# EAGLE design AS3364 DG412 bus mixer v1.3 (EAGLE 9.6.2)
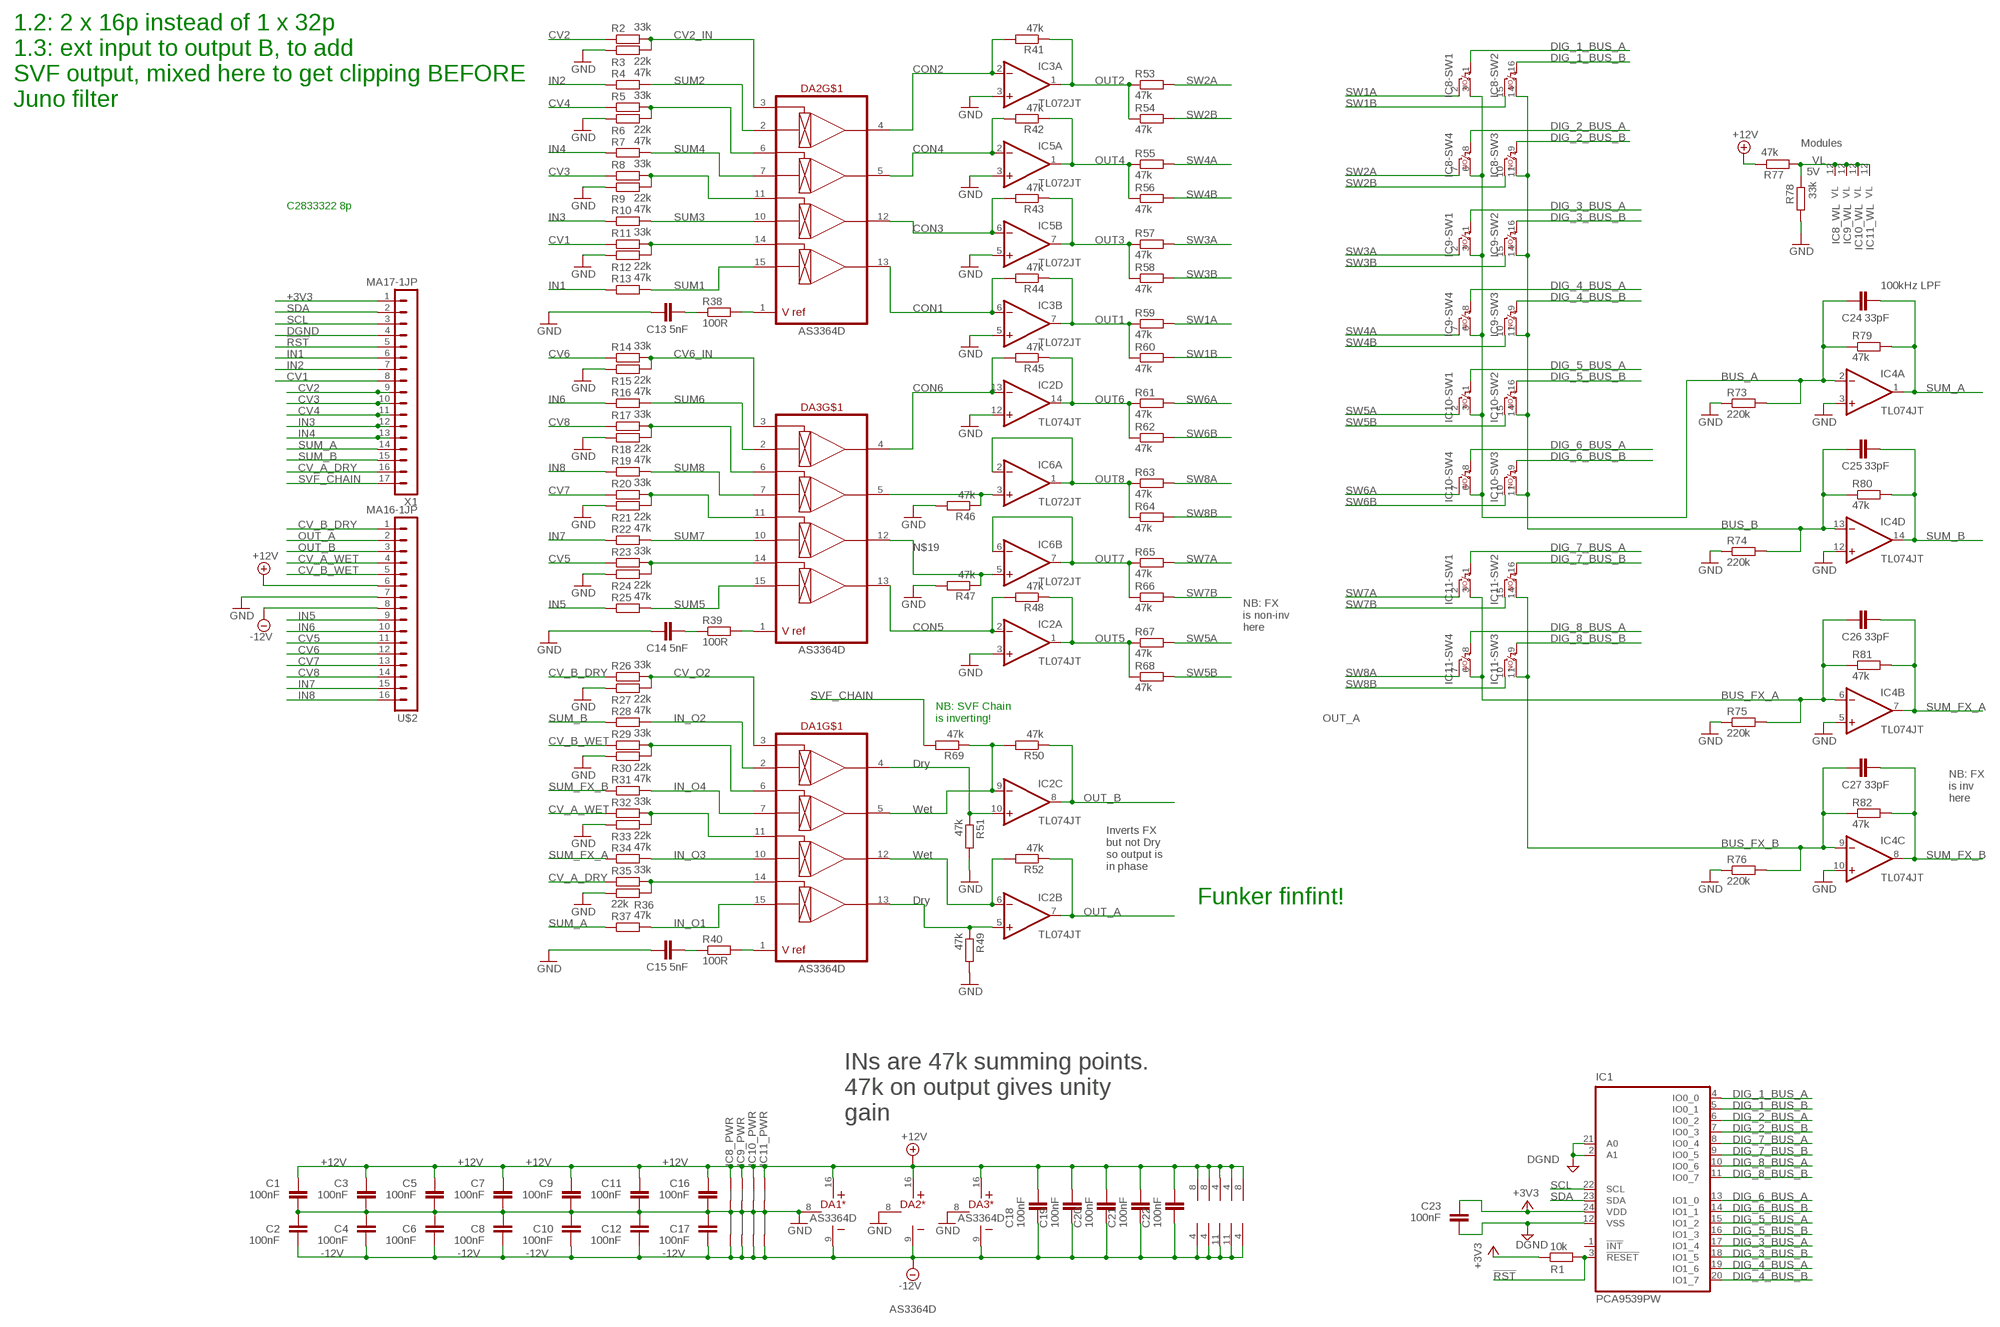
[diagram p0: schematic, sheet 1]

## Parts
C1  100nF  C-EUC0402  [C0402]
C2  100nF  C-EUC0402  [C0402]
C3  100nF  C-EUC0402  [C0402]
C4  100nF  C-EUC0402  [C0402]
C5  100nF  C-EUC0402  [C0402]
C6  100nF  C-EUC0402  [C0402]
C7  100nF  C-EUC0402  [C0402]
C8  100nF  C-EUC0402  [C0402]
C9  100nF  C-EUC0402  [C0402]
C10  100nF  C-EUC0402  [C0402]
C11  100nF  C-EUC0402  [C0402]
C12  100nF  C-EUC0402  [C0402]
C13  5nF  C-EU-J  [C0402-J]
C14  5nF  C-EU-J  [C0402-J]
C15  5nF  C-EU-J  [C0402-J]
C16  100nF  C-EUC0402  [C0402]
C17  100nF  C-EUC0402  [C0402]
C18  100nF  C-EUC0402  [C0402]
C19  100nF  C-EUC0402  [C0402]
C20  100nF  C-EUC0402  [C0402]
C21  100nF  C-EUC0402  [C0402]
C22  100nF  C-EUC0402  [C0402]
C23  100nF  C-EUC0402  [C0402]
C24  33pF  C-EU-J  [C0402-J]
C25  33pF  C-EU-J  [C0402-J]
C26  33pF  C-EU-J  [C0402-J]
C27  33pF  C-EU-J  [C0402-J]
DA1  AS3364D  [DIL16J]
DA2  AS3364D  [DIL16J]
DA3  AS3364D  [DIL16J]
IC1  PCA9539PW  [TSSOP24J]
IC2  TL074JT  [TSSOP14J]
IC3  TL072JT  [TSSOP8J]
IC4  TL074JT  [TSSOP14J]
IC5  TL072JT  [TSSOP8J]
IC6  TL072JT  [TSSOP8J]
IC8  DG412-J  [DIL16J]
IC9  DG412-J  [DIL16J]
IC10  DG412-J  [DIL16J]
IC11  DG412-J  [DIL16J]
R1  10k  R-EU_R0402  [R0402]
R2  33k  R-EU_R0402  [R0402]
R3  22k  R-EU_R0402  [R0402]
R4  47k  R-EU_R0402  [R0402]
R5  33k  R-EU_R0402  [R0402]
R6  22k  R-EU_R0402  [R0402]
R7  47k  R-EU_R0402  [R0402]
R8  33k  R-EU_R0402  [R0402]
R9  22k  R-EU_R0402  [R0402]
R10  47k  R-EU_R0402  [R0402]
R11  33k  R-EU_R0402  [R0402]
R12  22k  R-EU_R0402  [R0402]
R13  47k  R-EU_R0402  [R0402]
R14  33k  R-EU_R0402  [R0402]
R15  22k  R-EU_R0402  [R0402]
R16  47k  R-EU_R0402  [R0402]
R17  33k  R-EU_R0402  [R0402]
R18  22k  R-EU_R0402  [R0402]
R19  47k  R-EU_R0402  [R0402]
R20  33k  R-EU_R0402  [R0402]
R21  22k  R-EU_R0402  [R0402]
R22  47k  R-EU_R0402  [R0402]
R23  33k  R-EU_R0402  [R0402]
R24  22k  R-EU_R0402  [R0402]
R25  47k  R-EU_R0402  [R0402]
R26  33k  R-EU_R0402  [R0402]
R27  22k  R-EU_R0402  [R0402]
R28  47k  R-EU_R0402  [R0402]
R29  33k  R-EU_R0402  [R0402]
R30  22k  R-EU_R0402  [R0402]
R31  47k  R-EU_R0402  [R0402]
R32  33k  R-EU_R0402  [R0402]
R33  22k  R-EU_R0402  [R0402]
R34  47k  R-EU_R0402  [R0402]
R35  33k  R-EU_R0402  [R0402]
R36  22k  R-EU_R0402  [R0402]
R37  47k  R-EU_R0402  [R0402]
R38  100R  R-EU_R0402  [R0402]
R39  100R  R-EU_R0402  [R0402]
R40  100R  R-EU_R0402  [R0402]
R41  47k  R-EU_R0402  [R0402]
R42  47k  R-EU_R0402  [R0402]
R43  47k  R-EU_R0402  [R0402]
R44  47k  R-EU_R0402  [R0402]
R45  47k  R-EU_R0402  [R0402]
R46  47k  R-EU_R0402  [R0402]
R47  47k  R-EU_R0402  [R0402]
R48  47k  R-EU_R0402  [R0402]
R49  47k  R-EU_R0402  [R0402]
R50  47k  R-EU_R0402  [R0402]
R51  47k  R-EU_R0402  [R0402]
R52  47k  R-EU_R0402  [R0402]
R53  47k  R-EU_R0402  [R0402]
R54  47k  R-EU_R0402  [R0402]
R55  47k  R-EU_R0402  [R0402]
R56  47k  R-EU_R0402  [R0402]
R57  47k  R-EU_R0402  [R0402]
R58  47k  R-EU_R0402  [R0402]
R59  47k  R-EU_R0402  [R0402]
R60  47k  R-EU_R0402  [R0402]
R61  47k  R-EU_R0402  [R0402]
R62  47k  R-EU_R0402  [R0402]
R63  47k  R-EU_R0402  [R0402]
R64  47k  R-EU_R0402  [R0402]
R65  47k  R-EU_R0402  [R0402]
R66  47k  R-EU_R0402  [R0402]
R67  47k  R-EU_R0402  [R0402]
R68  47k  R-EU_R0402  [R0402]
R69  47k  R-EU_R0402  [R0402]
R73  220k  R-EU_R0402  [R0402]
R74  220k  R-EU_R0402  [R0402]
R75  220k  R-EU_R0402  [R0402]
R76  220k  R-EU_R0402  [R0402]
R77  47k  R-EU_R0402  [R0402]
R78  33k  R-EU_R0402  [R0402]
R79  47k  R-EU_R0402  [R0402]
R80  47k  R-EU_R0402  [R0402]
R81  47k  R-EU_R0402  [R0402]
R82  47k  R-EU_R0402  [R0402]
U$2  MA16-1JP  [SIP-PIN16-1J]
X1  MA17-1JP  [SIP-PIN17-1J]

## Nets
!RST: IC1.3(!RESET) R1.2 X1.5
+3V3: C23.2 IC1.24(VDD) R1.1 X1.1
+12V: C1.2 C3.2 C5.2 C7.2 C9.2 C11.2 C16.2 C18.2 C19.2 C20.2 C21.2 C22.2 DA1.16(*:V+) DA2.16(*:V+) DA3.16(*:V+) IC2.4(P:V+) IC3.8(P:V+) IC4.4(P:V+) IC5.8(P:V+) IC6.8(P:V+) IC8.13(_PWR:+15V) IC9.13(_PWR:+15V) IC10.13(_PWR:+15V) IC11.13(_PWR:+15V) R77.1 U$2.6
-12V: C2.1 C4.1 C6.1 C8.1 C10.1 C12.1 C17.1 C18.1 C19.1 C20.1 C21.1 C22.1 DA1.9(*:V-) DA2.9(*:V-) DA3.9(*:V-) IC2.11(P:V-) IC3.4(P:V-) IC4.11(P:V-) IC5.4(P:V-) IC6.4(P:V-) IC8.4(_PWR:-15V) IC9.4(_PWR:-15V) IC10.4(_PWR:-15V) IC11.4(_PWR:-15V) U$2.8
BUS_A: C24.1 IC4.2(A:-IN) IC8.3(-SW1:S) IC8.6(-SW4:S) IC9.3(-SW1:S) IC9.6(-SW4:S) IC10.3(-SW1:S) IC10.6(-SW4:S) R73.2 R79.1
BUS_B: C25.1 IC4.13(D:-IN) IC8.11(-SW3:S) IC8.14(-SW2:S) IC9.11(-SW3:S) IC9.14(-SW2:S) IC10.11(-SW3:S) IC10.14(-SW2:S) R74.2 R80.1
BUS_FX_A: C26.1 IC4.6(B:-IN) IC11.3(-SW1:S) IC11.6(-SW4:S) R75.2 R81.1
BUS_FX_B: C27.1 IC4.9(C:-IN) IC11.11(-SW3:S) IC11.14(-SW2:S) R76.2 R82.1
CON1: DA2.13(OUT4) IC3.6(B:-IN) R44.2
CON2: DA2.4(OUT1) IC3.2(A:-IN) R41.2
CON3: DA2.12(OUT3) IC5.6(B:-IN) R43.2
CON4: DA2.5(OUT2) IC5.2(A:-IN) R42.2
CON5: DA3.13(OUT4) IC2.2(A:-IN) R48.2
CON6: DA3.4(OUT1) IC2.13(D:-IN) R45.2
CON_O1: DA1.12(OUT3) IC2.6(B:-IN) R52.2
CV1: R11.1 X1.8
CV2: R2.1 X1.9
CV2_IN: DA2.3(CV1) R2.2 R3.2
CV3: R8.1 X1.10
CV4: R5.1 X1.11
CV5: R23.1 U$2.11
CV6: R14.1 U$2.12
CV6_IN: DA3.3(CV1) R14.2 R15.2
CV7: R20.1 U$2.13
CV8: R17.1 U$2.14
CV_A_DRY: R35.1 X1.16
CV_A_WET: R32.1 U$2.4
CV_B_DRY: R26.1 U$2.1
CV_B_WET: R29.1 U$2.5
CV_O2: DA1.3(CV1) R26.2 R27.2
DGND: C23.1 IC1.2(A1) IC1.12(VSS) IC1.21(A0) X1.4
DIG_1_BUS_A: IC1.4(IO0_0) IC8.1(-SW1:C)
DIG_1_BUS_B: IC1.5(IO0_1) IC8.16(-SW2:C)
DIG_2_BUS_A: IC1.6(IO0_2) IC8.8(-SW4:C)
DIG_2_BUS_B: IC1.7(IO0_3) IC8.9(-SW3:C)
DIG_3_BUS_A: IC1.17(IO1_4) IC9.1(-SW1:C)
DIG_3_BUS_B: IC1.18(IO1_5) IC9.16(-SW2:C)
DIG_4_BUS_A: IC1.19(IO1_6) IC9.8(-SW4:C)
DIG_4_BUS_B: IC1.20(IO1_7) IC9.9(-SW3:C)
DIG_5_BUS_A: IC1.15(IO1_2) IC10.1(-SW1:C)
DIG_5_BUS_B: IC1.16(IO1_3) IC10.16(-SW2:C)
DIG_6_BUS_A: IC1.13(IO1_0) IC10.8(-SW4:C)
DIG_6_BUS_B: IC1.14(IO1_1) IC10.9(-SW3:C)
DIG_7_BUS_A: IC1.8(IO0_4) IC11.1(-SW1:C)
DIG_7_BUS_B: IC1.9(IO0_5) IC11.16(-SW2:C)
DIG_8_BUS_A: IC1.10(IO0_6) IC11.8(-SW4:C)
DIG_8_BUS_B: IC1.11(IO0_7) IC11.9(-SW3:C)
GND: C1.1 C2.2 C3.1 C4.2 C5.1 C6.2 C7.1 C8.2 C9.1 C10.2 C11.1 C12.2 C13.1 C14.1 C15.1 C16.1 C17.2 DA1.8(*:GND) DA2.8(*:GND) DA3.8(*:GND) IC2.3(A:+IN) IC2.12(D:+IN) IC3.3(A:+IN) IC3.5(B:+IN) IC4.3(A:+IN) IC4.5(B:+IN) IC4.10(C:+IN) IC4.12(D:+IN) IC5.3(A:+IN) IC5.5(B:+IN) IC8.5(_PWR:AGND) IC9.5(_PWR:AGND) IC10.5(_PWR:AGND) IC11.5(_PWR:AGND) R3.1 R6.1 R9.1 R12.1 R15.1 R18.1 R21.1 R24.1 R27.1 R30.1 R33.1 R36.1 R46.2 R47.2 R49.2 R51.2 R73.1 R74.1 R75.1 R76.1 R78.2 U$2.7
IN1: R13.1 X1.6
IN2: R4.1 X1.7
IN3: R10.1 X1.12
IN4: R7.1 X1.13
IN5: R25.1 U$2.9
IN6: R16.1 U$2.10
IN7: R22.1 U$2.15
IN8: R19.1 U$2.16
IN_O1: DA1.15(IN4) R37.2
IN_O2: DA1.2(IN1) R28.2
IN_O3: DA1.10(IN3) R34.2
IN_O4: DA1.7(IN2) R31.2
N$1: DA3.1(VREF) R39.2
N$2: DA2.1(VREF) R38.2
N$3: DA3.6(CV2) R17.2 R18.2
N$4: DA3.5(OUT2) IC6.3(A:+IN) R46.1
N$5: DA3.11(CV3) R20.2 R21.2
N$6: DA1.5(OUT2) IC2.9(C:-IN) R50.2 R69.1
N$7: DA3.14(CV4) R23.2 R24.2
N$8: C14.2 R39.1
N$9: DA1.1(VREF) R40.2
N$10: DA2.6(CV2) R5.2 R6.2
N$11: DA1.6(CV2) R29.2 R30.2
N$12: DA2.11(CV3) R8.2 R9.2
N$13: DA1.11(CV3) R32.2 R33.2
N$14: C13.2 R38.1
N$15: DA1.14(CV4) R35.2 R36.2
N$16: C15.2 R40.1
N$17: DA1.4(OUT1) IC2.10(C:+IN) R51.1
N$18: DA1.13(OUT4) IC2.5(B:+IN) R49.1
N$19: DA3.12(OUT3) IC6.5(B:+IN) R47.1
N$21: DA2.14(CV4) R11.2 R12.2
OUT1: IC3.7(B:OUT) R44.1 R59.1 R60.1
OUT2: IC3.1(A:OUT) R41.1 R53.1 R54.1
OUT3: IC5.7(B:OUT) R43.1 R57.1 R58.1
OUT4: IC5.1(A:OUT) R42.1 R55.1 R56.1
OUT5: IC2.1(A:OUT) R48.1 R67.1 R68.1
OUT6: IC2.14(D:OUT) R45.1 R61.1 R62.1
OUT7: IC6.6(B:-IN) IC6.7(B:OUT) R65.1 R66.1
OUT8: IC6.1(A:OUT) IC6.2(A:-IN) R63.1 R64.1
OUT_A: IC2.7(B:OUT) R52.1 U$2.2
OUT_B: IC2.8(C:OUT) R50.1 U$2.3
SCL: IC1.22(SCL) X1.3
SDA: IC1.23(SDA) X1.2
SUM1: DA2.15(IN4) R13.2
SUM2: DA2.2(IN1) R4.2
SUM3: DA2.10(IN3) R10.2
SUM4: DA2.7(IN2) R7.2
SUM5: DA3.15(IN4) R25.2
SUM6: DA3.2(IN1) R16.2
SUM7: DA3.10(IN3) R22.2
SUM8: DA3.7(IN2) R19.2
SUM_A: C24.2 IC4.1(A:OUT) R37.1 R79.2 X1.14
SUM_B: C25.2 IC4.14(D:OUT) R28.1 R80.2 X1.15
SUM_FX_A: C26.2 IC4.7(B:OUT) R34.1 R81.2
SUM_FX_B: C27.2 IC4.8(C:OUT) R31.1 R82.2
SVF_CHAIN: R69.2 X1.17
SW1A: IC8.2(-SW1:D) R59.2
SW1B: IC8.15(-SW2:D) R60.2
SW2A: IC8.7(-SW4:D) R53.2
SW2B: IC8.10(-SW3:D) R54.2
SW3A: IC9.2(-SW1:D) R57.2
SW3B: IC9.15(-SW2:D) R58.2
SW4A: IC9.7(-SW4:D) R55.2
SW4B: IC9.10(-SW3:D) R56.2
SW5A: IC10.2(-SW1:D) R67.2
SW5B: IC10.15(-SW2:D) R68.2
SW6A: IC10.7(-SW4:D) R61.2
SW6B: IC10.10(-SW3:D) R62.2
SW7A: IC11.2(-SW1:D) R65.2
SW7B: IC11.15(-SW2:D) R66.2
SW8A: IC11.7(-SW4:D) R63.2
SW8B: IC11.10(-SW3:D) R64.2
VL: IC8.12(_WL:VL) IC9.12(_WL:VL) IC10.12(_WL:VL) IC11.12(_WL:VL) R77.2 R78.1
Unconnected: IC1.1(!INT)

## Notes on the sheet
- 1.2: 2 x 16p instead of 1 x 32p
  1.3: ext input to output B, to add
  SVF output, mixed here to get clipping BEFORE
  Juno filter
- Modules
- 5V
- C2833322 8p
- 100kHz LPF
- NB: FX
  is non-inv
  here
- NB: SVF Chain
  is inverting!
- Dry
- NB: FX
  is inv
  here
- Wet
- Wet
- Inverts FX
  but not Dry
  so output is
  in phase
- Dry | Funker finfint!
- INs are 47k summing points.
  47k on output gives unity
  gain

## Library data of the parts
C1-C12 C16-C23 = rcl:C-EU: CAPACITOR, European symbol; SPICEPREFIX: C
C13-C15 C24-C27 = joakim:C-EU-J: CAPACITOR, European symbol
DA1-DA3 = joakim:AS3364: AS3364 quad linear VCA, CEM3360 style. CV is 0 to 2V Vcc-Vee = 26V max, so +/-12V or +15V/-9V
IC1 = joakim:PCA9539: 16ch i/o expander. RPW version resets only internal statemachine to get out of stuck i2c-bus, other versions also reset outputs. Interrupt output requires external pull-up resistor for all variants. https://www.nxp.com/docs/en/data-sheet/PCA9539_PCA9539R.pdf
IC2 IC4 = joakim:TL074J: OP AMP
IC3 IC5 IC6 = joakim:TL072J: OP AMP
IC8-IC11 = joakim:DG412-J: Quad switch, normally open
R1-R69 R73-R82 = rcl:R-EU_: RESISTOR, European symbol; SPICEPREFIX: R
U$2 = joakim:MA16-1J
X1 = joakim:MA17-1J

## Board
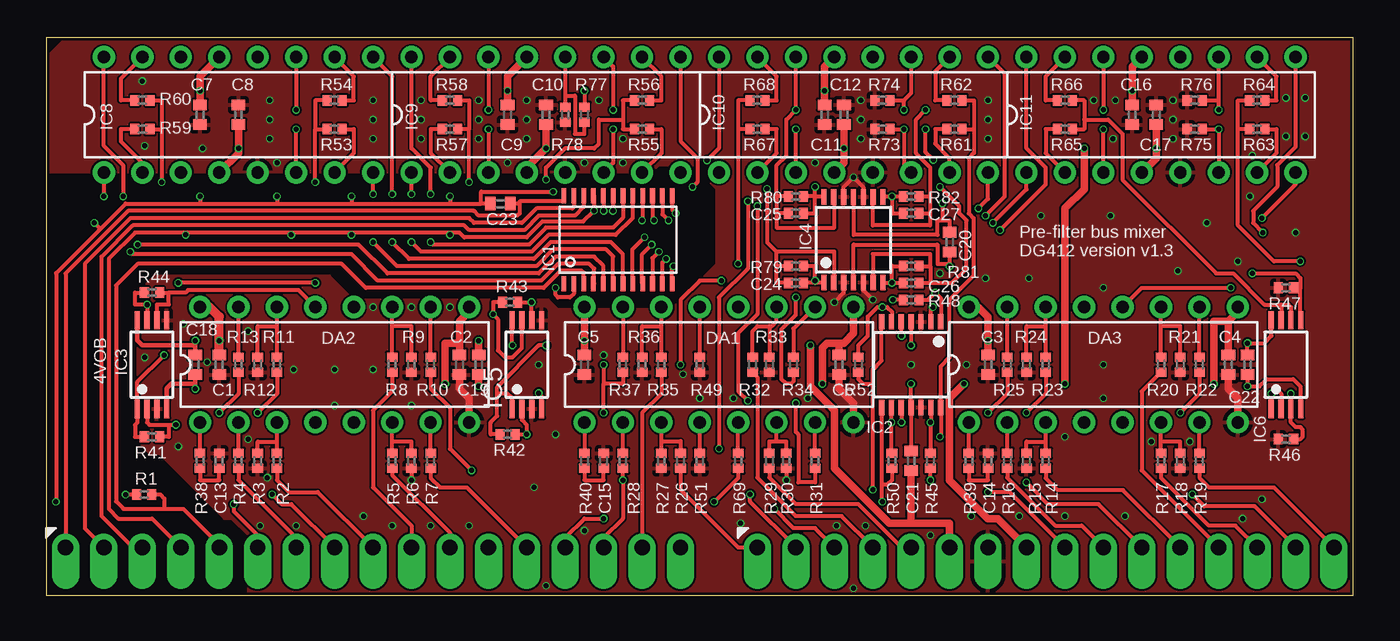
[diagram p1: board, top side]
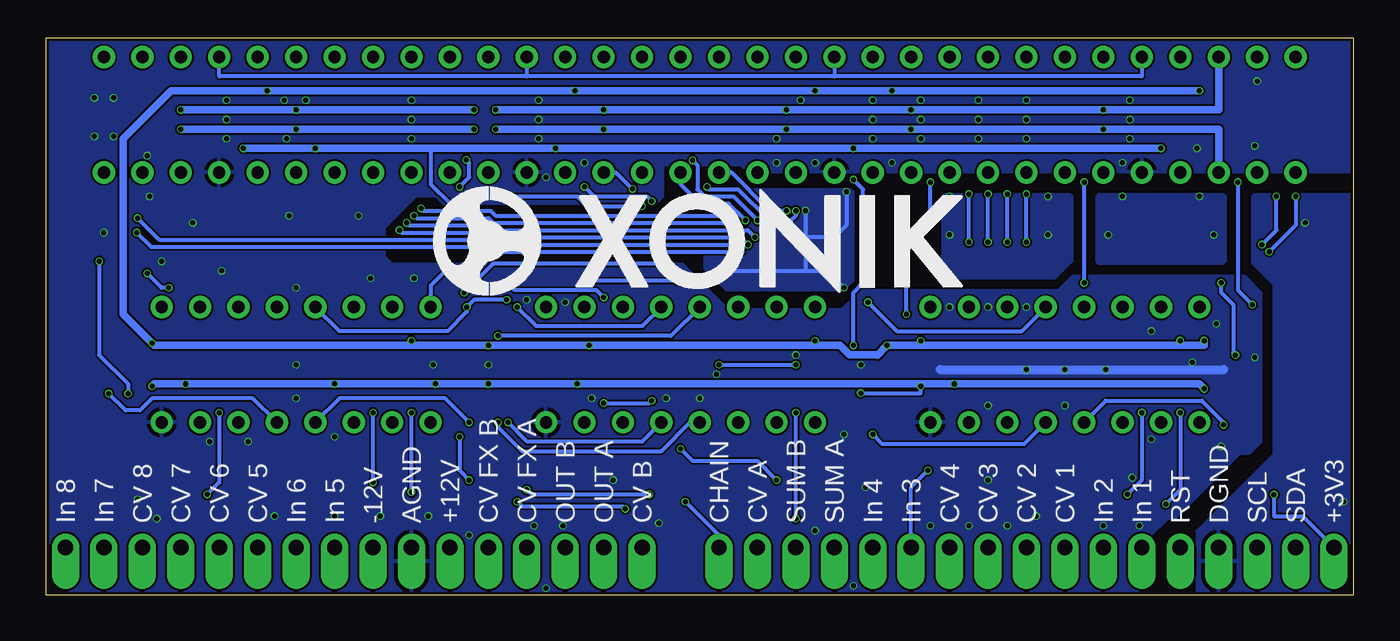
[diagram p2: board, bottom side, seen from below]

Size 86.36 x 36.83 mm. Coordinates in mm from the lower left corner, seen from the top.
Outline: 0,0 86.36,0 86.36,36.83 0,36.83 0,0
Copper layers (1*16): Top 0.035mm / dielectric 1.6mm / Bottom 0.035mm
Design rules "jlcpcb-2layers": minimum track width 5mil, minimum drill 0.3mm, track to track 5mil, track to pad 5mil, pad to pad 5mil, via to via 5mil, smd to smd 5mil, copper to edge 0.2mm, drill to drill 6mil, minimum pad ring 10mil, minimum via ring 3mil, stop-mask expansion 4mil, vias tented up to drill 0mil, thermal gap 10mil

### Footprints (pad centres in the part's own frame; a part is rotated, then mirrored left to right if it is on the bottom)
C0402 = smd 0.7 x 0.9: 1 -0.65,0; 2 0.65,0
C0402-J = smd 0.6 x 0.7: 1 -0.5,0; 2 0.5,0
DIL16J = drill 0.813: 1 -8.89,-3.81; 2 -6.35,-3.81; 3 -3.81,-3.81; 4 -1.27,-3.81; 5 1.27,-3.81; 6 3.81,-3.81; 7 6.35,-3.81; 8 8.89,-3.81; 9 8.89,3.81; 10 6.35,3.81; 11 3.81,3.81; 12 1.27,3.81; 13 -1.27,3.81; 14 -3.81,3.81; 15 -6.35,3.81; 16 -8.89,3.81
TSSOP24J = smd 0.305 x 0.991: 1 -3.575,-2.918; 2 -2.925,-2.918; 3 -2.275,-2.918; 4 -1.625,-2.918; 5 -0.975,-2.918; 6 -0.325,-2.918; 7 0.325,-2.918; 8 0.975,-2.918; 9 1.625,-2.918; 10 2.275,-2.918; 11 2.925,-2.918; 12 3.575,-2.918; 13 3.575,2.918; 14 2.925,2.918; 15 2.275,2.918; 16 1.625,2.918; 17 0.975,2.918; 18 0.325,2.918; 19 -0.325,2.918; 20 -0.975,2.918; 21 -1.625,2.918; 22 -2.275,2.918; 23 -2.925,2.918; 24 -3.575,2.918
TSSOP14J = smd 0.35 x 1: 1 -1.95,-2.825; 2 -1.3,-2.825; 3 -0.65,-2.825; 4 0,-2.825; 5 0.65,-2.825; 6 1.3,-2.825; 7 1.95,-2.825; 8 1.95,2.825; 9 1.3,2.825; 10 0.65,2.825; 11 0,2.825; 12 -0.65,2.825; 13 -1.3,2.825; 14 -1.95,2.825
TSSOP8J = smd 1.2 x 0.35: 1 -2.925,0.975; 2 -2.925,0.325; 3 -2.925,-0.325; 4 -2.925,-0.975; 5 2.925,-0.975; 6 2.925,-0.325; 7 2.925,0.325; 8 2.925,0.975
R0402 = smd 0.6 x 0.7: 1 -0.5,0; 2 0.5,0
SIP-PIN16-1J = drill 1.016 offset: 1 -19.05,0; 2 -16.51,0; 3 -13.97,0; 4 -11.43,0; 5 -8.89,0; 6 -6.35,0; 7 -3.81,0; 8 -1.27,0; 9 1.27,0; 10 3.81,0; 11 6.35,0; 12 8.89,0; 13 11.43,0; 14 13.97,0; 15 16.51,0; 16 19.05,0
SIP-PIN17-1J = drill 1.016 offset: 1 -20.32,0; 2 -17.78,0; 3 -15.24,0; 4 -12.7,0; 5 -10.16,0; 6 -7.62,0; 7 -5.08,0; 8 -2.54,0; 9 0,0; 10 2.54,0; 11 5.08,0; 12 7.62,0; 13 10.16,0; 14 12.7,0; 15 15.24,0; 16 17.78,0; 17 20.32,0

### Placement (x,y rotation side)
C1  11.43,15.24 90 top
C2  27.3,15.24 270 top
C3  62.23,15.24 90 top
C4  78.1,15.24 270 top
C5  35.56,15.24 90 top
C6  52.39,15.24 270 top
C7  10.16,31.75 90 top
C8  12.7,31.75 90 top
C9  30.48,31.75 90 top
C10  33.02,31.75 90 top
C11  51.44,31.75 90 top
C12  52.71,31.75 90 top
C13  11.43,8.89 270 top
C14  62.23,8.89 270 top
C15  36.83,8.89 270 top
C16  71.75,31.75 90 top
C17  73.34,31.75 90 top
C18  9.84,15.24 90 top
C19  28.57,15.24 90 top
C20  59.69,23.34 270 top
C21  57.15,8.89 270 top
C22  79.38,15.24 90 top
C23  30,25.88 0 top
C24  49.53,21.75 0 top
C25  49.53,25.24 0 top
C26  57.15,21.75 180 top
C27  57.15,25.24 180 top
DA1  44.45,15.24 0 top
DA2  19.05,15.24 0 top
DA3  69.85,15.24 0 top
IC1  37.78,23.5 0 top
IC2  57.15,15.24 180 top
IC3  6.98,15.24 90 top
IC4  53.34,23.5 0 top
IC5  31.75,15.24 90 top
IC6  81.91,15.24 90 top
IC8  12.7,31.75 0 top
IC9  33.02,31.75 0 top
IC10  53.34,31.75 0 top
IC11  73.66,31.75 0 top
R1  6.48,6.67 0 top
R2  15.24,8.89 90 top
R3  13.97,8.89 90 top
R4  12.7,8.89 90 top
R5  22.86,8.89 90 top
R6  24.13,8.89 90 top
R7  25.4,8.89 90 top
R8  22.86,15.24 90 top
R9  24.13,15.24 90 top
R10  25.4,15.24 90 top
R11  15.24,15.24 90 top
R12  13.97,15.24 90 top
R13  12.7,15.24 90 top
R14  66.04,8.89 90 top
R15  64.77,8.89 90 top
R16  63.5,8.89 90 top
R17  73.66,8.89 90 top
R18  74.93,8.89 90 top
R19  76.2,8.89 90 top
R20  73.66,15.24 90 top
R21  74.93,15.24 90 top
R22  76.2,15.24 90 top
R23  66.04,15.24 90 top
R24  64.77,15.24 90 top
R25  63.5,15.24 90 top
R26  41.91,8.89 90 top
R27  40.64,8.89 90 top
R28  38.1,8.89 90 top
R29  47.78,8.89 90 top
R30  48.9,8.89 90 top
R31  50.8,8.89 90 top
R32  46.67,15.24 90 top
R33  47.78,15.24 90 top
R34  49.37,15.24 90 top
R35  40.64,15.24 90 top
R36  39.37,15.24 90 top
R37  38.1,15.24 90 top
R38  10.16,8.89 90 top
R39  60.96,8.89 90 top
R40  35.56,8.89 90 top
R41  6.98,10.48 0 top
R42  30.48,10.64 0 top
R43  30.64,19.37 0 top
R44  6.98,20 0 top
R45  58.42,8.89 90 top
R46  81.91,10.32 180 top
R47  81.91,20.32 180 top
R48  57.15,19.53 180 top
R49  43.18,15.24 270 top
R50  55.88,8.89 90 top
R51  43.18,8.89 270 top
R52  53.66,15.24 90 top
R53  19.05,30.8 0 top
R54  19.05,32.7 0 top
R55  39.37,30.8 0 top
R56  39.37,32.7 0 top
R57  26.67,30.8 180 top
R58  26.67,32.7 180 top
R59  6.35,30.8 180 top
R60  6.35,32.7 180 top
R61  60.01,30.8 180 top
R62  60.01,32.7 180 top
R63  80.01,30.8 0 top
R64  80.01,32.7 0 top
R65  67.31,30.8 180 top
R66  67.31,32.7 180 top
R67  46.99,30.8 0 top
R68  46.99,32.7 0 top
R69  45.72,8.89 270 top
R73  55.25,30.8 0 top
R74  55.25,32.7 0 top
R75  75.88,30.8 0 top
R76  75.88,32.7 0 top
R77  35.56,31.75 270 top
R78  34.29,31.75 270 top
R79  49.53,20.64 0 top
R80  49.53,26.35 0 top
R81  57.15,20.64 180 top
R82  57.15,26.35 180 top
U$1  [XONIK_LOGO_35]  60.8,19.84 0 bottom
U$2  66.04,3.17 0 top
X1  21.59,3.17 0 top

### Tracks (layer width: path | path; a pad name or v marks a point on that pad's centre or on a via)
!RST
  Top 0.254: IC1.3 35.51,21.32 35.4,21.43 33.97,21.43 32.86,20.32 21.11,20.32 19.53,21.91 6.03,21.91 4.6,20.48 4.6,6.21 5.1,5.71 6.35,5.71 | X1.5 11.43,3.33 9.05,5.71 7.8,5.71 | 6.35,5.71 6.64,5.71 | R1.2 7.54,6.67 7.8,6.4 7.8,5.71 | 6.35,5.71 7.8,5.71
+3V3  (via drill 0.33)
  Top 0.254: IC1.24 34.21,26.09 34.15,26.04 31.27,26.04 31.27,25.88 | 31.27,25.88 C23.2 | 31.27,25.88 31.27,25.24 31.11,25.08 28.57,25.08 28.26,25.4 5.4,25.4 1.27,21.27 X1.1 | R1.1 v5.23,6.66
  Bottom 0.254: v5.23,6.66 5.23,5.24 3.33,5.24 X1.1
+12V  (via drill 0.33, 0.35)
  Top 0.254: v35.56,33.34 R77.1 | IC4.4 53.34,23.18 58.88,23.18 58.9,23.16 58.9,21.89 59.53,21.89 v59.69,21.73 C20.2 | C22.2 v79.38,16.67 80.49,16.67 80.96,17.14 80.96,18.14 IC6.8 | IC2.4 v57.15,16.51 | C20.2 | IC5.8 30.77,16.53 v30.8,16.51
  Top 0.305: IC3.8 6.01,16.85 6.35,16.51 9.84,16.51 | 9.84,16.51 C18.2 | 9.84,16.51 v9.84,16.83
  Top 0.508: C3.2 v62.23,16.83 62.23,18.41 61.6,19.05 DA3.16 | C5.2 v35.56,16.83 DA1.16 | C7.2 v10.16,33.34 10.16,34.29 IC8.13 | C9.2 v30.48,33.34 30.48,34.29 IC9.13 | C11.2 v51.44,33.34 51.44,34.92 IC10.13 | C16.2 v71.75,33.34 71.75,34.92 IC11.13 | C19.2 v28.57,16.83 | U$2.6 59.69,4.76 57.15,4.76 | v50.48,16.51 50.48,13.81 52.07,12.22 52.07,8.41 55.72,4.76 57.15,4.76 | C21.2 57.15,4.76
  Top 0.61: C1.2 v11.43,16.83 11.43,18.41 10.79,19.05 DA2.16
  Bottom 0.254: v59.69,21.73 60.96,20.46 DA3.16
  Bottom 0.508: 35.56,16.51 v50.48,16.51 v57.15,16.51 62.23,16.51 | v9.84,16.83 9.84,16.51 11.43,16.51 | v10.16,33.34 v30.48,33.34 v35.56,33.34 v51.44,33.34 v71.75,33.34 78.1,33.34 81.28,30.16 81.28,18.57 v79.38,16.67 79.22,16.51 62.23,16.51 | v35.56,16.83 35.56,16.51 | v62.23,16.83 62.23,16.51 | 11.43,16.51 28.57,16.51 | 28.57,16.51 v30.8,16.51 31.43,15.88 31.45,15.89 33.28,15.89 33.9,16.51 35.56,16.51 | v11.43,16.83 11.43,16.51 | v28.57,16.83 28.57,16.51
-12V  (via drill 0.33, 0.35)
  Top 0.254: v57.15,13.97 IC2.11 C21.1 | IC4.11 53.34,23.81 58.9,23.81 58.9,24.77 59.21,24.77 | C22.1 v79.38,13.81 80.17,13.81 80.64,14.29 82.39,14.29 82.89,13.79 IC6.4 | 59.21,24.77 59.69,24.77 C20.1 | v59.21,25.89 59.21,24.77 | IC5.4 32.73,13.19 v32.54,13.37
  Top 0.305: IC3.4 7.96,13.68 8.26,13.97 9.84,13.97 | 9.84,13.97 C18.1 | 9.84,13.97 v9.84,13.65
  Top 0.508: DA2.9 27.94,18.73 27.3,18.1 27.3,16.67 | 27.3,16.67 C2.1 | 27.3,16.67 26.35,16.67 v26.35,13.97 | DA3.9 78.74,18.73 78.1,18.1 | 78.1,18.1 C4.1 | 78.1,18.1 77.15,18.1 v77.15,13.97 | C6.1 52.39,16.67 | C8.1 v12.7,29.53 12.7,29.21 IC8.4 | IC9.4 31.75,28.26 v33.02,29.53 C10.1 | C12.1 v52.71,29.53 52.71,28.57 IC10.4 | C17.1 v73.34,29.53 73.34,28.89 IC11.4 | v68.58,29.53 68.58,26.83 67.31,25.56 v67.31,13.97 | U$2.8 62.87,5.08 62.23,5.08 59.69,7.62 59.69,13.02 v60.64,13.97 | 52.39,16.67 52.71,16.67 53.34,17.3 DA1.9 | v28.57,13.81 C19.1 | v51.28,13.97 51.28,16.35 51.59,16.67 52.39,16.67
  Bottom 0.254: v59.21,25.89 59.69,25.89 60.96,27.16 60.96,29.53 | v68.58,29.53 69.21,29.53 | v32.54,13.37 28.57,13.37 28.57,13.97
  Bottom 0.508: v9.84,13.65 10.16,13.97 v26.35,13.97 28.57,13.97 | 28.57,13.97 v51.28,13.97 v57.15,13.97 v60.64,13.97 v67.31,13.97 v77.15,13.97 79.22,13.97 v79.38,13.81 | v12.7,29.53 v33.02,29.53 v52.71,29.53 60.96,29.53 69.21,29.53 v73.34,29.53 | 28.57,13.97 v28.57,13.81
BUS_A  (via drill 0.33)
  Top 0.254: v29.21,30.8 IC9.3 | v37.47,30.8 37.47,28.57 IC9.6 | IC8.6 v16.51,30.8 | IC10.3 v49.53,30.8 | IC10.6 56.67,28.42 v56.67,30.8 R73.2 | IC4.2 52.07,20.7 52.07,22.7 48.26,22.7 | v47.62,26.85 47.62,23.34 48.26,22.7 | R79.1 48.26,20.64 48.26,21.75 | 48.26,21.75 48.26,22.7 | C24.1 48.26,21.75
  Bottom 0.254: IC10.3 48.74,27.94 47.64,26.85 v47.62,26.85
  Bottom 0.508: IC8.3 8.89,30.8 v16.51,30.8 v29.21,30.8 v37.47,30.8 v49.53,30.8 v56.67,30.8
BUS_B  (via drill 0.33)
  Top 0.254: IC8.11 v16.51,32.07 | IC9.14 v29.21,32.07 | IC9.11 37.47,34.92 v37.47,32.07 | IC10.14 v49.53,32.07 48.9,31.43 48.9,29.05 48.26,28.42 48.26,26.35 | v56.67,32.07 56.67,32.7 | R74.2 56.67,32.7 | 48.26,26.35 48.26,25.24 | 48.26,25.24 48.26,24.29 52.07,24.29 52.07,26.29 IC4.13 | R80.1 48.26,26.35 | IC10.11 57.15,33.18 56.67,32.7 | C25.1 48.26,25.24
  Bottom 0.508: IC8.14 8.89,32.07 v16.51,32.07 v29.21,32.07 v37.47,32.07 v49.53,32.07 v56.67,32.07
BUS_FX_A  (via drill 0.33)
  Top 0.254: IC11.3 v69.85,30.8 | IC11.6 v77.47,30.8 R75.2 | R81.1 58.42,20.64 | IC4.6 54.61,20.7 54.61,22.54 58.42,22.54 58.42,21.75 | v58.61,28.77 58.1,29.27 v58.1,30.8 | 58.42,21.75 58.42,20.64 | v59.05,26.99 60.33,25.72 60.33,25.24 60.8,24.77 60.8,21.59 59.85,20.64 58.42,20.64 | C26.1 58.42,21.75
  Bottom 0.254: v58.61,28.77 58.42,28.57 58.42,27.62 v59.05,26.99
  Bottom 0.508: v77.47,30.8 v69.85,30.8 v58.1,30.8
BUS_FX_B  (via drill 0.33)
  Top 0.254: IC11.14 v69.85,32.07 | v77.47,32.07 77.47,32.7 | 77.47,32.7 IC11.11 | R76.2 77.47,32.7 | R82.1 58.42,26.35 | 58.42,25.24 58.42,24.45 54.61,24.45 54.61,26.29 IC4.9 | 58.42,25.24 58.42,26.35 | 58.42,26.35 58.42,28.26 57.47,29.21 57.47,31.43 v58.1,32.07 | C27.1 58.42,25.24
  Bottom 0.508: v77.47,32.07 v69.85,32.07 v58.1,32.07
CON1
  Top 0.254: DA2.13 16.67,20.16 9.37,20.16 9.21,20 8.1,20 | IC3.6 7.3,18.17 7.3,19.21 8.1,19.21 8.1,20 | R44.2 8.1,20
CON2  (via drill 0.35)
  Top 0.254: IC3.2 6.66,11.44 6.83,11.27 v8.57,11.27 8.1,11.27 8.1,10.48 R41.2
  Bottom 0.254: DA2.4 16.35,12.86 10,12.86 8.57,11.43 v8.57,11.27
CON3  (via drill 0.35)
  Top 0.254: R43.2 v32.07,19.37 v32.08,19.36 IC5.6
  Bottom 0.254: DA2.12 21.91,17.46 30.16,17.46 v32.07,19.37
CON4  (via drill 0.33)
  Top 0.254: R42.2 v31.75,10.64 31.72,10.67 31.75,10.7 31.75,11.27 31.43,11.6 IC5.2
  Bottom 0.254: DA2.5 21.75,10 31.11,10 v31.75,10.64
CON5  (via drill 0.33)
  Top 0.254: v58.58,19.05 58.59,19.04 58.45,18.89 IC2.2 | R48.2 v55.93,19.53
  Bottom 0.254: DA3.13 66.99,17.46 59.85,17.46 58.58,18.73 v58.58,19.05 58.1,19.53 v55.93,19.53
CON6  (via drill 0.33)
  Top 0.254: R45.2 v58.42,11.43 58.45,11.46 IC2.13
  Bottom 0.254: DA3.4 66.99,13.02 60.01,13.02 v58.42,11.43
CON_O1  (via drill 0.33)
  Top 0.254: IC2.6 55.88,18.09 55.88,18.73 55.56,19.05 v55.25,19.05 54.93,19.05 54.29,18.41 54.29,17.14 53.66,16.51 R52.2
  Bottom 0.254: DA1.12 46.99,17.78 53.98,17.78 v55.25,19.05
CV1  (via drill 0.33, 0.35)
  Top 0.254: R11.1 15.24,13.34 v13.97,12.06 | v14.92,6.67 15.56,6.03 16.19,6.03 X1.8
  Bottom 0.254: v13.97,12.06 13.97,7.62 v14.92,6.67
CV2
  Top 0.254: R2.1 15.24,7.62 16.03,6.83 17.94,6.83 X1.9
CV2_IN
  Top 0.254: R2.2 15.24,10.16 | 15.24,10.16 DA2.3 | R3.2 13.97,10.16 15.24,10.16
CV3
  Top 0.254: R8.1 22.86,13.49 21.59,12.22 21.59,7.14 24.13,4.6 X1.10
CV4
  Top 0.254: R5.1 22.86,7.94 26.67,4.13 X1.11
CV5  (via drill 0.33)
  Top 0.254: R23.1 66.04,13.34 v64.77,12.06 | U$2.11 69.53,6.03 66.2,6.03 v64.77,7.46
  Bottom 0.254: v64.77,7.46 v64.77,12.06
CV6
  Top 0.254: R14.1 66.04,7.75 66.83,6.96 71.14,6.96 U$2.12
CV6_IN
  Top 0.254: R14.2 66.04,10.16 | 66.04,10.16 DA3.3 | R15.2 64.77,10.16 66.04,10.16
CV7
  Top 0.254: U$2.13 72.39,8.26 72.39,13.47 R20.1
CV8
  Top 0.254: R17.1 73.66,7.78 76.83,4.6 78.58,4.6 U$2.14
CV_A_DRY
  Top 0.254: R35.1 40.64,13.34 39.37,12.06 39.37,3.33 X1.16
CV_A_WET
  Top 0.254: U$2.4 52.55,5.24 49.53,5.24 46.99,7.78 46.99,14.42 R32.1
CV_B_DRY
  Top 0.254: R26.1 41.91,6.99 45.72,3.17 U$2.1
CV_B_WET
  Top 0.254: R29.1 47.78,7.78 49.53,6.03 53.66,6.03 56.52,3.17 U$2.5
CV_O2
  Top 0.254: R27.2 40.64,10.18 | 40.64,10.18 DA1.3 | R26.2 41.91,10.18 40.64,10.18
DGND  (via drill 0.33)
  Top 0.254: IC1.21 36.2,26.38 v36.2,25.42 35.48,24.7 32.8,24.7 31.75,23.65 27.62,23.65 27.3,23.97 26.67,23.97 | v41.43,21.75 41.36,21.67 IC1.12 | v33.5,26.67 28.73,26.67 28.73,25.88 | C23.1 28.73,25.88 | 3.49,24.13 5.24,25.88 10.16,25.88 | 3.49,24.13 0.65,21.28 0.65,6.2 v0.64,6.19 | 26.67,23.97 20.16,23.97 | 20.16,23.97 16.19,23.97 | 16.19,23.97 9.21,23.97 | 9.21,23.97 5.87,23.97 4.13,22.23 4.13,5.71 4.76,5.08 6.98,5.08 X1.4 | 10.16,25.88 15.24,25.88 | 15.24,25.88 20.16,25.88 | 20.16,25.88 26.67,25.88 | 26.67,25.88 28.73,25.88 | IC1.2 34.86,19.93 34.61,19.68 33.81,19.68 33.66,19.84 v33.66,20.32 | v10.16,26.35 10.16,25.88 | v15.24,26.35 15.24,25.88 | v16.19,23.81 16.19,23.97 | v9.21,23.81 9.21,23.97 | v3.17,24.61 3.49,24.29 3.49,24.13 | v20.16,26.35 20.16,25.88 | v26.67,26.35 26.67,25.88 | v26.67,23.81 26.67,23.97 | v20.16,23.81 20.16,23.97
  Bottom 0.254: v36.2,25.42 36.2,23.65 | 36.2,23.65 36.2,21.43 | v41.43,21.75 41.12,21.43 36.2,21.43 | v33.5,26.67 33.5,24.45 34.29,23.65 36.2,23.65 | 36.2,21.43 34.77,21.43 v33.66,20.32
  pour Bottom: 33.02,26.67 33.18,26.83 41.59,26.83 42.86,25.56 42.86,21.59 41.43,20.16 33.66,20.16 33.02,20.8
  pour Bottom: 10.32,4.29 5.24,9.37 5.24,20.48 6.67,21.91 6.67,26.35 6.51,26.51 -0.32,26.51 -0.32,-0.48 10.32,-0.48
  pour Bottom: 8.57,26.51 8.41,26.35 8.41,22.07 8.57,21.91 16.83,21.91 16.99,22.07 16.99,26.35 16.83,26.51
  pour Bottom: 18.57,26.35 18.57,22.07 19.68,20.95 26.67,20.95 27.15,21.43 27.15,26.35 26.99,26.51 18.73,26.51
DIG_1_BUS_A  (via drill 0.33)
  Top 0.254: IC1.4 36.2,20.61 36.2,21.59 35.88,21.91 33.81,21.91 32.7,20.8 21.91,20.8 20.16,22.54 5.71,22.54 v5.56,22.7 | IC8.1 v3.81,26.35
  Bottom 0.254: v3.81,26.35 3.81,24.45 v5.56,22.7
DIG_1_BUS_B  (via drill 0.33)
  Top 0.254: IC1.5 36.81,21.77 36.2,22.38 33.66,22.38 32.54,21.27 22.54,21.27 20.64,23.18 v6.03,23.18 | IC8.16 3.81,29.69 5.08,28.42 v5.08,26.35
  Bottom 0.254: v6.03,23.18 5.08,24.13 v5.08,26.35
DIG_2_BUS_A  (via drill 0.33)
  Top 0.254: IC1.6 37.46,22.39 36.99,22.86 33.5,22.86 32.38,21.75 23.18,21.75 v21.59,23.34 | v21.59,26.51 IC8.8
  Bottom 0.254: v21.59,23.34 v21.59,26.51
DIG_2_BUS_B  (via drill 0.33)
  Top 0.254: IC1.7 38.11,22.54 37.31,23.34 33.34,23.34 32.23,22.23 23.97,22.23 v22.86,23.34 | v22.86,26.51 22.86,34.29 IC8.9
  Bottom 0.254: v22.86,23.34 v22.86,26.51
DIG_3_BUS_A  (via drill 0.33)
  Top 0.254: IC1.17 38.76,24.95 37.62,23.81 33.18,23.81 32.07,22.7 24.77,22.7 v24.13,23.34 | v24.13,26.51 IC9.1
  Bottom 0.254: v24.13,23.34 v24.13,26.51
DIG_3_BUS_B  (via drill 0.33)
  Top 0.254: IC1.18 38.11,24.93 37.47,24.29 33.02,24.29 31.91,23.18 25.56,23.18 v25.4,23.34 | IC9.16 24.13,29.53 25.4,28.26 v25.4,26.51
  Bottom 0.254: v25.4,23.34 v25.4,26.51
DIG_4_BUS_A  (via drill 0.33)
  Top 0.254: IC1.19 37.47,25.4 v37.44,25.4
  Bottom 0.254: v37.44,25.4 38.56,25.4 41.1,27.94 IC9.8
DIG_4_BUS_B  (via drill 0.33)
  Top 0.254: IC1.20 36.83,26.39 v36.83,25.4 | v42.7,26.99 43.02,27.3 43.02,28.89 41.91,30 IC9.9
  Bottom 0.254: v36.83,25.4 36.83,25.08 37.15,24.77 38.58,24.77 40.64,26.83 42.55,26.83 v42.7,26.99
DIG_5_BUS_A  (via drill 0.33)
  Top 0.254: IC1.15 40.06,24.87 v40.16,24.77
  Bottom 0.254: v40.16,24.77 41.28,25.88 43.18,25.88 44.45,27.15 IC10.1
DIG_5_BUS_B  (via drill 0.33)
  Top 0.254: IC1.16 39.41,24.8 v39.37,24.77 | IC10.16 44.45,29.53 v43.66,28.73
  Bottom 0.254: v43.66,28.73 43.34,28.42 43.34,26.83 42.86,26.35 40.96,26.35 v39.37,24.77
DIG_6_BUS_A  (via drill 0.33)
  Top 0.254: IC1.13 41.36,25.48 v41.59,25.24 | v61.6,25.56 62.23,26.19 IC10.8
  Bottom 0.254: v41.59,25.24 41.75,25.08 56.67,25.08 56.99,25.4 61.44,25.4 v61.6,25.56
DIG_6_BUS_B  (via drill 0.33)
  Top 0.254: IC1.14 40.71,25.17 v41.12,24.77 | v62.07,25.08 63.34,26.35 63.34,34.45 IC10.9
  Bottom 0.254: v41.12,24.77 41.28,24.61 56.83,24.61 57.15,24.92 61.91,24.92 v62.07,25.08
DIG_7_BUS_A  (via drill 0.33)
  Top 0.254: IC1.8 38.74,20.6 38.74,22.86 v39.53,23.65 | v62.55,24.61 64.77,26.83 IC11.1
  Bottom 0.254: v39.53,23.65 40.01,24.13 57.15,24.13 57.47,24.45 62.39,24.45 v62.55,24.61
DIG_7_BUS_B  (via drill 0.33)
  Top 0.254: IC1.9 39.37,20.61 39.37,22.54 v40.01,23.18 | v63.02,24.13 66.04,27.15 66.04,28.26 64.77,29.53 IC11.16
  Bottom 0.254: v63.02,24.13 62.87,23.97 57.63,23.97 57.31,23.65 40.48,23.65 v40.01,23.18
DIG_8_BUS_A  (via drill 0.33)
  Top 0.254: IC1.10 40.06,22.28 v40.48,22.7 | v80.33,24.92 82.55,27.15 IC11.8
  Bottom 0.254: v80.33,24.92 78.9,23.5 57.79,23.5 57.47,23.18 40.96,23.18 v40.48,22.7
DIG_8_BUS_B  (via drill 0.33)
  Top 0.254: IC1.11 40.71,21.98 v40.96,22.23 | v80.39,23.97 79.75,24.61 79.75,25.4 81.34,26.99 81.34,28.42 82.55,29.62 IC11.9
  Bottom 0.254: v80.39,23.97 79.44,23.02 57.85,23.02 57.53,22.7 41.43,22.7 v40.96,22.23
GND  (via drill 0.33)
  Top 0.254: R6.1 v24.13,7.62 | R30.1 v48.9,7.62 | IC4.12 52.69,26.97 v53.34,27.62 53.99,26.97 IC4.10 | IC4.3 52.69,19.99 v52.07,19.37 | IC4.5 53.99,20.15 v54.61,19.53
  Top 0.508: C2.2 27.3,13.65 27.94,13.02 DA2.8 | DA3.8 78.74,13.02 78.09,13.66 78.09,14.58 C4.2 | C6.2 52.39,13.65 53.34,12.7 DA1.8
  Bottom 0.61: 27.3,14.92 8.57,14.92
  other vias: 6.51,29.69 6.35,33.97 14.76,32.7 14.76,31.43 14.76,30.16 21.59,32.7 21.59,31.43 21.59,30.16 24.77,32.7 24.77,31.43 24.77,30.16 28.57,32.7 28.57,31.43 28.57,30.16 31.75,32.7 31.75,31.43 31.75,30.16 36.51,32.7 35.56,28.57 30.48,28.57 15.24,28.57 10.32,29.53 53.82,32.7 53.82,31.43 53.82,30.16 50.8,28.57 62.23,32.7 62.23,31.43 62.23,30.16 69.21,32.7 70.48,30.16 70.64,32.7 74.45,30.16 74.45,31.43 74.45,32.7 81.91,32.86 83.19,32.86 83.19,30.32 81.91,30.32 78.74,22.07 76.68,24.61 70.33,25.08 69.85,20.32 74.77,21.43 65.72,25.08 64.93,20.95 62.07,20.95 6.51,15.72 14.61,7.78 20.95,5.24 16.51,4.6 25.4,4.6 27.94,4.6 33.02,0.64 22.86,4.6 32.23,7.14 45.88,4.76 52.23,4.6 80.33,6.35 82.55,23.97 38.1,30.16 38.1,28.57 79.53,26.35 79.69,29.05 57.15,15.24 60.8,15.24 61.12,5.24 64.29,5.24 67.31,5.24 16.35,14.92 19.05,14.92 21.59,14.92 24.13,12.54 19.05,12.54 36.83,15.88 43.18,13.02 42.07,14.61 50.32,13.02 45.4,13.02 67.31,10.48 69.85,13.02 69.85,15.24 73.02,10.16 75.56,10.16 32.54,15.24 10.64,15.4 8.73,9.84 9.05,17.94 13.33,17.46 13.33,10.32 24.13,19.05 21.59,19.05 26.67,19.05 33.66,10.64 35.56,4.29 58.42,3.97 53.34,0.48 71.28,5.24 14.13,4.6 59.05,21.27 54.13,4.6 79.06,5.08
  pour Bottom: -1.11,36.99 87.15,36.99 87.15,-0.48 13.33,-0.48 13.33,3.97 12.22,5.08 11.75,5.08 7.46,9.37 6.83,9.37 6.03,10.16 6.03,20 7.14,21.11 18.57,21.11 19.53,20.16 32.54,20.16 33.81,18.89 41.28,18.89 44.29,21.91 63.5,21.91 63.98,22.38 63.98,24.29 61.91,26.35 60.64,26.35 60.17,25.88 46.04,25.88 45.56,26.35 45.56,28.42 40.48,28.42 40.01,27.94 -1.11,27.94
  pour Top: 1.91,37.31 86.84,37.31 86.84,-0.95 13.33,-0.95 13.33,3.97 12.22,5.08 11.75,5.08 7.46,9.37 6.83,9.37 6.03,10.16 6.03,20 7.14,21.11 18.73,21.11 20.32,19.53 33.18,19.53 33.81,18.89 41.28,18.89 44.29,21.91 44.29,26.83 42.7,28.42 40.48,28.42 40.01,27.94 -0.79,27.94 -0.79,34.77 1.91,37.47
IN1  (via drill 0.33, 0.35)
  Top 0.254: R13.1 12.7,13.34 v11.43,12.06 | v12.38,6.03 12.38,5.56 13.97,3.97 X1.6
  Bottom 0.254: v11.43,12.06 11.43,6.99 v12.38,6.03
IN2
  Top 0.254: R4.1 12.7,7.62 16.51,3.81 X1.7
IN3  (via drill 0.33)
  Top 0.254: v28.1,8.26 26.67,9.68 26.67,12.38 25.4,13.65 R10.1
  Bottom 0.254: X1.12 29.21,7.14 v28.1,8.26
IN4
  Top 0.254: R7.1 25.4,7.75 26.01,7.14 27.78,7.14 X1.13
IN5  (via drill 0.33)
  Top 0.254: R25.1 63.5,13.34 v62.23,12.06 | U$2.9 63.66,6.83 v62.23,6.83
  Bottom 0.254: v62.23,6.83 v62.23,12.06
IN6
  Top 0.254: R16.1 63.5,7.78 66.67,4.6 68.42,4.6 U$2.10
IN7  (via drill 0.33)
  Top 0.254: v74.93,12.06 76.2,13.34 R22.1 | U$2.15 79.85,5.87 76.52,5.87 v75.72,6.67
  Bottom 0.254: v74.93,12.06 74.93,7.46 v75.72,6.67
IN8
  Top 0.254: R19.1 76.2,7.78 76.83,7.14 81.12,7.14 U$2.16
IN_O1
  Top 0.254: DA1.15 R37.2
IN_O2
  Top 0.254: R28.2 DA1.2
IN_O3
  Top 0.254: R34.2 49.37,17.62 DA1.10
IN_O4
  Top 0.254: R31.2 DA1.7
N$1
  Top 0.254: R39.2 DA3.1
N$2
  Top 0.254: R38.2 DA2.1
N$3
  Top 0.254: R17.2 73.66,10.16 | 73.66,10.16 DA3.6 | R18.2 74.93,10.16 73.66,10.16
N$4  (via drill 0.33)
  Top 0.254: v82.23,13.34 IC6.3 82.24,11.44 82.56,11.11 82.87,11.11 83.03,10.95 83.03,10.48 82.87,10.32 R46.1
  Bottom 0.254: DA3.5 72.71,13.02 79.38,13.02 80.17,12.22 81.12,12.22 v82.23,13.34
N$5
  Top 0.254: R20.2 73.66,17.78 | 73.66,17.78 DA3.11 | R21.2 74.93,17.78 73.66,17.78
N$6  (via drill 0.33)
  Top 0.254: R50.2 55.85,9.42 v55.85,11.43 IC2.9 | R69.1 DA1.5
  Bottom 0.254: DA1.5 46.99,10.16 54.58,10.16 v55.85,11.43
N$7
  Top 0.254: R23.2 66.04,17.78 | 66.04,17.78 DA3.14 | R24.2 64.77,17.78 66.04,17.78
N$8
  Top 0.254: R39.1 60.96,7.62 62.23,7.62 C14.2
N$9
  Top 0.254: DA1.1 R40.2
N$10
  Top 0.254: R5.2 22.86,10.16 | 22.86,10.16 DA2.6 | R6.2 24.13,10.16 22.86,10.16
N$11
  Top 0.254: R29.2 47.78,10.16 48.26,10.16 | 48.26,10.16 DA1.6 | R30.2 48.9,10.16 48.26,10.16
N$12
  Top 0.254: R8.2 22.86,17.78 | 22.86,17.78 DA2.11 | R9.2 24.13,17.78 22.86,17.78
N$13
  Top 0.254: R32.2 46.67,17.46 46.99,17.78 47.78,17.78 | DA1.11 48.26,18.1 47.94,17.78 47.78,17.78 | 47.78,17.78 R33.2
N$14
  Top 0.254: R38.1 10.16,7.62 11.43,7.62 C13.2
N$15
  Top 0.254: R35.2 40.64,17.78 | 40.64,17.78 DA1.14 | R36.2 39.37,17.78 40.64,17.78
N$16
  Top 0.254: R40.1 35.56,7.62 36.83,7.62 C15.2
N$17  (via drill 0.33)
  Top 0.254: R51.1 DA1.4 | IC2.10 56.52,12.4 v56.52,11.43
  Bottom 0.254: v56.52,11.43 56.52,11.11 54.93,9.53 45.72,9.53 43.82,11.43 DA1.4
N$18  (via drill 0.33)
  Top 0.254: v56.52,17.14 56.5,17.16 IC2.5 | R49.1 DA1.13
  Bottom 0.254: DA1.13 45.09,17.14 v56.52,17.14
N$19  (via drill 0.33)
  Top 0.254: IC6.5 82.87,18.19 82.87,20.32 | 82.87,20.32 R47.1 | DA3.12 72.39,20.32 v78.26,20.32 | v79.69,21.27 82.55,21.27 82.87,20.95 82.87,20.32
  Bottom 0.254: v79.69,21.27 78.74,20.32 v78.26,20.32
N$21
  Top 0.254: R11.2 15.24,17.78 | 15.24,17.78 DA2.14 | R12.2 13.97,17.78 15.24,17.78
OUT1  (via drill 0.33)
  Top 0.254: IC3.7 6.67,18.17 v6.67,19.21 5.87,19.21 5.87,20 R44.1 | R59.1 7.62,30.8 | R60.1 7.62,32.7 7.62,30.8 | 7.62,30.8 v7.62,27.3
  Bottom 0.254: v7.62,27.3 7.62,20.16 v6.67,19.21
OUT2  (via drill 0.33)
  Top 0.254: R54.1 17.78,32.7 17.78,30.8 | 17.78,30.8 R53.1 | v17.78,20.64 v8.73,20.64 | v17.78,27.3 17.78,30.8 | R41.1 5.87,10.48 5.87,11.27 6.01,11.41 IC3.1 6.01,14.11 v7.78,15.88
  Bottom 0.254: v8.73,20.64 8.73,20 7.94,19.21 7.94,16.03 v7.78,15.88 | v17.78,20.64 v17.78,27.3
OUT3  (via drill 0.33)
  Top 0.254: R58.1 27.94,32.7 27.94,30.8 | 27.94,30.8 R57.1 | v27.94,27.3 27.94,30.8 | R43.1 29.53,19.37 v29.53,18.57 29.84,18.26 29.84,16.19 30.32,15.72 30.8,15.72 31.43,16.35 IC5.7
  Bottom 0.254: v29.53,18.57 29.53,23.02 27.94,24.61 v27.94,27.3
OUT4  (via drill 0.33)
  Top 0.254: R55.1 38.1,30.8 38.1,31.43 | R56.1 38.1,32.7 38.1,31.43 | v33.02,16.51 32.54,16.51 29.8,13.77 29.8,13.34 | v33.02,27.46 33.02,28.26 34.29,29.53 36.2,29.53 36.51,29.84 36.51,31.43 38.1,31.43 | R42.1 29.37,10.64 29.37,11.43 29.8,11.86 29.8,13.34 | IC5.1 30.77,13.04 30.48,13.34 29.8,13.34
  Bottom 0.254: v33.02,27.46 32.38,26.83 32.38,20.64 33.02,20 v33.02,16.51
OUT5  (via drill 0.33)
  Top 0.254: R68.1 45.72,32.7 45.72,30.8 | R67.1 45.72,30.8 | 45.72,30.8 v45.72,21.91 | IC2.1 59.1,19.64 v58.74,20 58.26,19.53 R48.1
  Bottom 0.254: v45.72,21.91 56.83,21.91 v58.74,20
OUT6  (via drill 0.33)
  Top 0.254: R61.1 61.3,30.8 | R62.1 61.28,32.7 61.3,32.68 61.3,30.8 | 61.3,30.8 61.3,29.23 60.96,28.89 60.96,25.24 61.28,24.92 61.28,21.11 59.69,19.53 59.69,15.72 59.1,15.13 IC2.14 59.1,10.52 v59.05,10.48 | v58.42,7.62 R45.1
  Bottom 0.254: v59.05,10.48 59.05,8.26 v58.42,7.62
OUT7
  Top 0.254: R65.1 68.58,30.8 68.58,31.43 | 68.58,31.43 68.58,32.7 R66.1 | 68.58,31.43 70.17,31.43 71.12,30.48 71.12,27.46 77.31,21.27 78.42,21.27 80.49,19.21 81.6,19.21 | 81.6,19.21 82.07,19.21 82.24,19.04 IC6.6 | 81.6,19.21 81.6,18.17 IC6.7
OUT8  (via drill 0.33)
  Top 0.254: R63.1 78.74,30.8 | 78.74,30.8 78.74,32.7 R64.1 | 78.74,30.8 78.74,24.45 81.12,22.07 v82.87,22.07 | IC6.1 80.94,13.31 v80.96,13.34 81.12,13.49 81.44,13.49 81.6,13.34 IC6.2
  Bottom 0.254: v82.87,22.07 82.87,15.88 80.96,13.97 v80.96,13.34
OUT_A  (via drill 0.33)
  Top 0.254: U$2.2 46.51,6.19 v46.51,6.67 | IC2.7 55.2,15.51 54.61,14.92 54.61,13.97 | v54.61,6.99 54.61,13.97 | R52.1 53.66,14.29 53.98,13.97 54.61,13.97
  Bottom 0.254: v54.61,6.99 54.29,6.67 v46.51,6.67
OUT_B  (via drill 0.33)
  Top 0.254: U$2.3 50.8,4.45 49.37,4.45 v48.1,5.71 | IC2.8 55.2,7.3 | 55.2,7.3 55.2,6.24 v55.25,6.19 | R50.1 55.88,7.62 55.56,7.3 55.2,7.3
  Bottom 0.254: v48.1,5.71 48.26,5.87 54.93,5.87 v55.25,6.19
SCL
  Top 0.254: IC1.22 35.51,25.66 34.93,25.08 32.54,25.08 31.59,24.13 27.94,24.13 27.62,24.45 5.71,24.45 3.65,22.38 3.65,5.24 5.71,3.17 X1.3
SDA
  Top 0.254: IC1.23 34.86,25.65 34.77,25.56 32.38,25.56 31.43,24.61 28.26,24.61 27.94,24.92 5.56,24.92 2.54,21.91 2.54,4.45 X1.2
SUM1
  Top 0.254: R13.2 DA2.15
SUM2
  Top 0.254: R4.2 DA2.2
SUM3
  Top 0.254: R10.2 DA2.10
SUM4
  Top 0.254: R7.2 DA2.7
SUM5
  Top 0.254: R25.2 DA3.15
SUM6
  Top 0.254: R16.2 DA3.2
SUM7
  Top 0.254: R22.2 DA3.10
SUM8
  Top 0.254: R19.2 DA3.7
SUM_A  (via drill 0.33)
  Top 0.254: 50.8,20.64 51.36,20.64 IC4.1 | 50.8,20.64 v50.8,20.8 50.8,21.75 C24.2 | 50.8,20.64 R79.2 | v36.83,15.24 36.83,13.97 | 36.83,13.97 38.1,13.97 R37.1 | v44.61,20.8 43.18,20.8 41.91,19.53 v41.91,15.24 | v36.83,5.08 35.56,5.08 34.29,3.81 X1.14 | v36.83,12.06 36.83,13.97
  Bottom 0.254: v44.61,20.8 v50.8,20.8 | v41.91,15.24 v36.83,15.24 | v36.83,5.08 v36.83,12.06
SUM_B  (via drill 0.33)
  Top 0.254: 50.8,26.35 R80.2 | 50.8,26.35 51.36,26.35 IC4.14 | 50.8,26.35 v50.8,26.99 | R28.1 v38.1,7.62 38.1,5.08 36.83,3.81 X1.15 | v46.36,26.04 46.36,21.59 44.45,19.68 v44.45,9.68 | C25.2 50.8,25.24 50.8,26.35
  Bottom 0.254: v50.8,26.99 50.17,26.35 46.67,26.35 v46.36,26.04 | v44.45,9.68 43.66,8.89 39.37,8.89 v38.1,7.62
SUM_FX_A  (via drill 0.33)
  Top 0.254: IC4.7 55.32,20.64 v55.88,20.64 | v55.88,20.64 R81.2 | v49.53,19.68 49.53,18.53 48.58,17.57 48.58,14.29 48.9,13.97 49.21,13.97 49.37,14.13 R34.1 | v55.88,20.64 55.88,21.75 C26.2
  Bottom 0.254: v49.53,19.68 50.01,20.16 55.4,20.16 v55.88,20.64
SUM_FX_B  (via drill 0.33)
  Top 0.254: IC4.8 55.32,26.35 v55.88,26.35 | v55.88,26.35 R82.2 | v46.36,12.86 45.72,13.49 45.72,17.3 46.99,18.57 v46.99,25.72 | R31.1 50.8,7.46 49.69,7.46 49.69,10.64 49.53,10.79 v49.53,12.7 | v55.88,26.35 55.88,25.24 C27.2
  Bottom 0.254: v55.88,26.35 51.28,26.35 50.64,25.72 v46.99,25.72 | v49.53,12.7 46.51,12.7 v46.36,12.86
SVF_CHAIN  (via drill 0.33)
  Top 0.254: R69.2 45.72,7.75 44.16,6.19 v44.13,6.19
  Bottom 0.254: v44.13,6.19 41.91,3.97 X1.17
SW1A
  Top 0.254: R59.2 4.92,30.8 4.92,30 6.35,28.57 IC8.2
SW1B
  Top 0.254: IC8.15 4.92,34.13 4.92,32.7 R60.2
SW2A
  Top 0.254: R53.2 20.32,30.8 20.32,29.21 IC8.7
SW2B
  Top 0.254: R54.2 20.32,32.7 20.32,34.29 IC8.10
SW3A
  Top 0.254: R57.2 25.4,30.8 25.4,29.21 IC9.2
SW3B
  Top 0.254: R58.2 25.4,32.7 25.4,34.29 IC9.15
SW4A
  Top 0.254: R55.2 40.64,30.8 40.64,29.21 IC9.7
SW4B
  Top 0.254: R56.2 40.64,32.7 40.64,34.29 IC9.10
SW5A
  Top 0.254: IC10.2 48.26,29.21 48.26,30.8 R67.2
SW5B
  Top 0.254: R68.2 48.26,32.7 48.26,34.29 IC10.15
SW6A
  Top 0.254: IC10.7 59.69,28.89 58.74,29.84 58.74,30.8 R61.2
SW6B
  Top 0.254: R62.2 58.74,32.7 58.74,34.61 IC10.10
SW7A
  Top 0.254: R65.2 66.04,30.8 66.04,29.21 IC11.2
SW7B
  Top 0.254: R66.2 66.04,32.7 66.04,34.29 IC11.15
SW8A
  Top 0.254: R63.2 81.28,30.8 81.28,29.21 IC11.7
SW8B
  Top 0.254: R64.2 81.28,32.7 81.28,34.29 IC11.10
VL
  Top 0.254: IC9.12 34.29,33.02 | 34.29,33.02 R78.1 | 34.29,33.02 34.93,33.02 34.93,30.48 35.56,30.48 R77.2
  Bottom 0.254: IC8.12 13.97,34.29 34.29,34.29 | IC11.12 74.93,34.29 54.61,34.29 | 34.29,34.29 54.61,34.29 | IC10.12 54.61,34.29 | IC9.12 34.29,34.29

### Text on the board
tNames: Pre-filter bus mixer / DG412 version v1.3 | 4VOB
bNames: +3V3 | SDA | SCL | DGND | RST | In 1 | In 2 | CV 1 | CV 2 | CV 3 | CV 4 | In 3 | In 4 | SUM A | SUM B | CV A | CHAIN | CV B | OUT A | OUT B | CV FX A | CV FX B | +12V | AGND | -12V | In 5 | In 6 | CV 5 | CV 6 | CV 7 | CV 8 | In 7 | In 8